# EAGLE design module_HC05 (EAGLE 9.4.1)
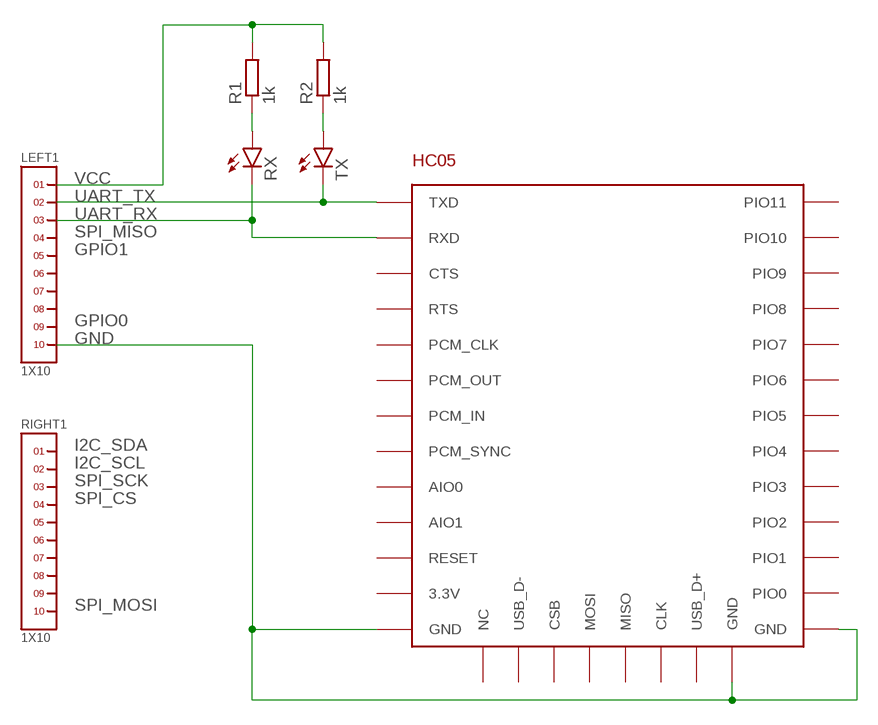
[diagram p0: schematic, sheet 1]

## Parts
LEFT1  1X10  [1X10]
R1  1k  R-EU_R0603  [R0603]
R2  1k  R-EU_R0603  [R0603]
RIGHT1  1X10  [1X10]
RX  LEDCHIP-LED0603  [CHIP-LED0603]
TX  LEDCHIP-LED0603  [CHIP-LED0603]
U$1  HC05  [HC05]

## Nets
GND: LEFT1.10 U$1.GND@1(GND) U$1.GND@2(GND) U$1.GND@3(GND)
N$1: R2.1 TX.A
N$2: R1.1 RX.A
N$3: LEFT1.2 TX.C U$1.TX(TXD)
N$4: LEFT1.3 RX.C U$1.RX(RXD)
VCC: LEFT1.1 R1.2 R2.2
Unconnected: LEFT1.4 LEFT1.5 LEFT1.6 LEFT1.7 LEFT1.8 LEFT1.9 RIGHT1.1 RIGHT1.2 RIGHT1.3 RIGHT1.4 RIGHT1.5 RIGHT1.6 RIGHT1.7 RIGHT1.8 RIGHT1.9 RIGHT1.10 U$1.3.3V U$1.AIO0 U$1.AIO1 U$1.CLK U$1.CSB U$1.CTS U$1.MISO U$1.MOSI U$1.NC U$1.PCM_CLK U$1.PCM_IN U$1.PCM_OUT U$1.PCM_SYNC U$1.PIO0 U$1.PIO1 U$1.PIO2 U$1.PIO3 U$1.PIO4 U$1.PIO5 U$1.PIO6 U$1.PIO7 U$1.PIO8 U$1.PIO9 U$1.PIO10 U$1.PIO11 U$1.RESET U$1.RTS U$1.USB_D+ U$1.USB_D-

## Notes on the sheet
- VCC
- UART_TX
- UART_RX
- SPI_MISO
- GPIO1
- GPIO0
- GND
- I2C_SDA
- I2C_SCL
- SPI_SCK
- SPI_CS
- SPI_MOSI

## Library data of the parts
LEFT1 RIGHT1 = headers(2mm):1X10
R1 R2 = rcl:R-EU_: RESISTOR, European symbol; SPICEPREFIX: R
RX TX = led:LED: LED OSRAM: - CHIPLED LG R971, LG N971, LY N971, LG Q971, LY Q971, LO R971, LY R971 LH N974, LH R974 LS Q976, LO Q976, LY Q976 LO Q996 - Hyper CHIPLED LW Q18S LB Q993, LB Q99A, LB R99A - SideLED LS A670, LO A670, LY A670, LG A670, LP A670 LB A673, LV A673, LT A673, LW A673 LH A674 LY A675 LS A676, LA A676, LO A676, LY A676, LW A676 LS A679, LY A679, LG A679 - Hyper Micro SIDELED® LS Y876, LA Y876, LO Y876, LY Y876 LT Y87S - SmartLED LW L88C, LW L88S LB L89C, LB L89S, LG L890 LS L89K, LO L89K, LY L89K LS L896, LA L896, LO L896, LY L896 - TOPLED LS T670, LO T670, LY T670, LG T670, LP T670 LSG T670, LSP T670, LSY T670, LOP T670, LYG T670 LG T671, LOG T671, LSG T671 LB T673, LV T673, LT T673, LW T673 LH T674 LS T676, LA T676, LO T676, LY T676, LB T676, LH T676, LSB T676, LW T676 LB T67C, LV T67C, LT T67C, LS T67K, LO T67K, LY T67K, LW E67C LS E67B, LA E67B, LO E67B, LY E67B, LB E67C, LV E67C, LT E67C LW T67C LS T679, LY T679, LG T679 LS T770, LO T770, LY T770, LG T770, LP T770 LB T773, LV T773, LT T773, LW T773 LH T774 LS E675, LA E675, LY E675, LS T675 LS T776, LA T776, LO T776, LY T776, LB T776 LHGB T686 LT T68C, LB T68C - Hyper Mini TOPLED® LB M676 - Mini TOPLED Santana® LG M470 LS M47K, LO M47K, LY M47K Source: http://www.osram.convergy.de LUXEON: - LUMILED® LXK2-PW12-R00, LXK2-PW12-S00, LXK2-PW14-U00, LXK2-PW14-V00 LXK2-PM12-R00, LXK2-PM12-S00, LXK2-PM14-U00 LXK2-PE12-Q00, LXK2-PE12-R00, LXK2-PE12-S00, LXK2-PE14-T00, LXK2-PE14-U00 LXK2-PB12-K00, LXK2-PB12-L00, LXK2-PB12-M00, LXK2-PB14-N00, LXK2-PB14-P00, LXK2-PB14-Q00 LXK2-PR12-L00, LXK2-PR12-M00, LXK2-PR14-Q00, LXK2-PR14-R00 LXK2-PD12-Q00, LXK2-PD12-R00, LXK2-PD12-S00 LXK2-PH12-R00, LXK2-PH12-S00 LXK2-PL12-P00, LXK2-PL12-Q00, LXK2-PL12-R00 Source: www.luxeon.com KINGBRIGHT: KA-3528ASYC Source: www.kingbright.com
U$1 = RadioShield:HC05

## Board
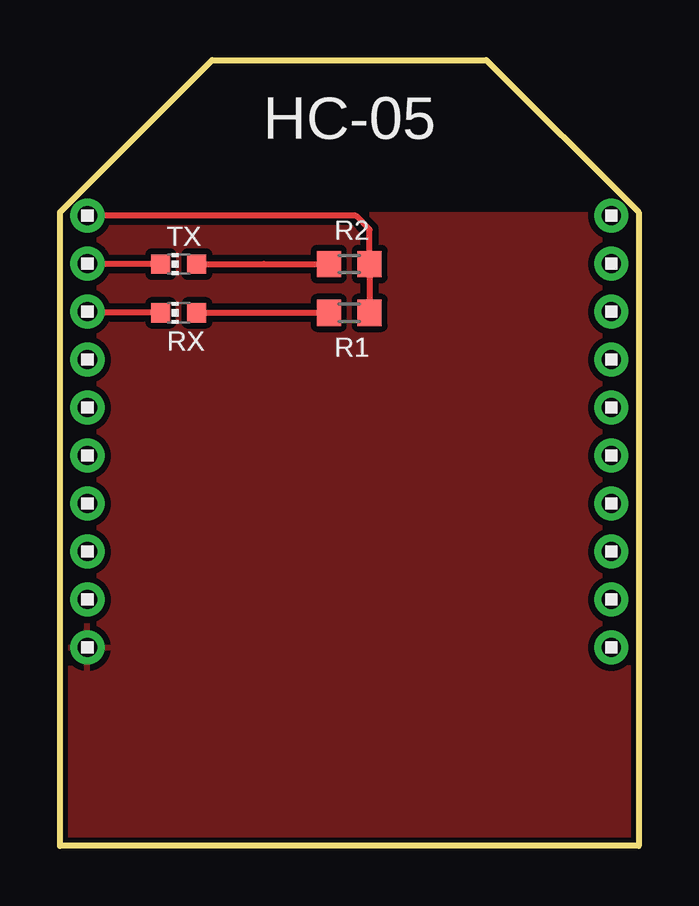
[diagram p1: board, top side]
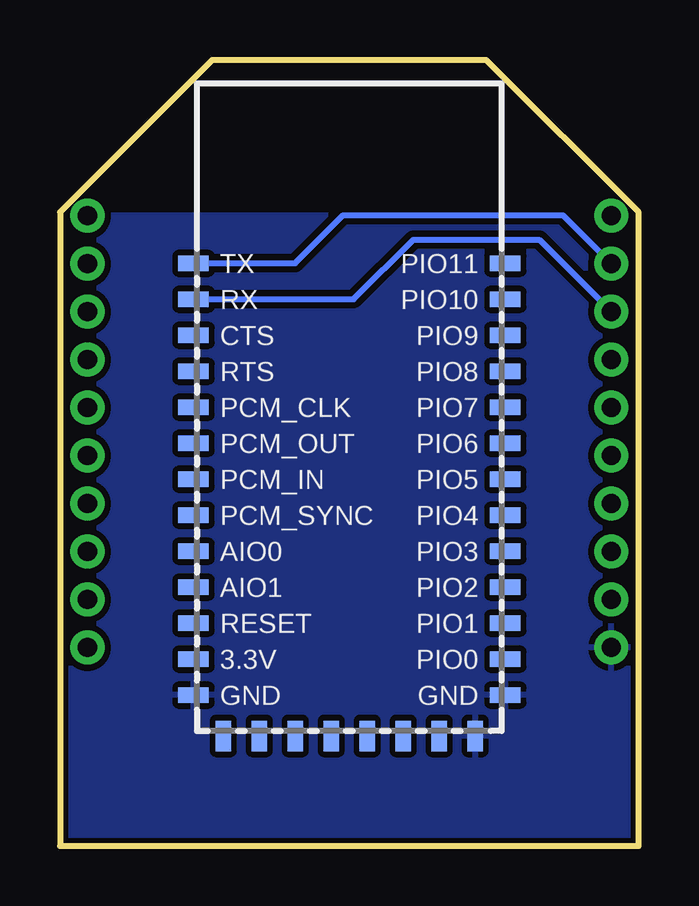
[diagram p2: board, bottom side, seen from below]

Size 24.13 x 32.77 mm. Coordinates in mm from the lower left corner, seen from the top.
Outline: 0,0 0,26.42 6.35,32.77 17.78,32.77 24.13,26.42 24.13,0 0,0
Copper layers (1*16): Top 0.035mm / dielectric 1.5mm / Bottom 0.035mm
Design rules "SparkFun-2-layer-STANDARD": minimum track width 10mil, minimum drill 20mil, track to track 10mil, track to pad 8mil, pad to pad 8mil, via to via 10mil, smd to smd 8mil, copper to edge 8mil, drill to drill 8mil, minimum pad ring 10mil, minimum via ring 10mil, stop-mask expansion 4mil, vias tented up to drill 25mil, thermal gap 10mil

### Footprints (pad centres in the part's own frame; a part is rotated, then mirrored left to right if it is on the bottom)
1X10 = drill 0.8 pad 1.422: 1 -9,0; 2 -7,0; 3 -5,0; 4 -3,0; 5 -1,0; 6 1,0; 7 3,0; 8 5,0; 9 7,0; 10 9,0
R0603 = smd 1 x 1.1: 1 -0.85,0; 2 0.85,0
CHIP-LED0603 = smd 0.8 x 0.8: A 0,-0.75; C 0,0.75
HC05 = smd 1.27 x 0.635: 3.3V -6.5,-10.5; AIO0 -6.5,-6; AIO1 -6.5,-7.5; CTS -6.5,3; GND@1 -6.5,-12; GND@3 6.5,-12; PCM_CLK -6.5,0; PCM_IN -6.5,-3; PCM_OUT -6.5,-1.5; PCM_SYNC -6.5,-4.5; PIO0 6.5,-10.5; PIO1 6.5,-9; PIO2 6.5,-7.5; PIO3 6.5,-6; PIO4 6.5,-4.5; PIO5 6.5,-3; PIO6 6.5,-1.5; PIO7 6.5,0; PIO8 6.5,1.5; PIO9 6.5,3; PIO10 6.5,4.5; PIO11 6.5,6; RESET -6.5,-9; RTS -6.5,1.5; RX -6.5,4.5; TX -6.5,6 | smd 0.635 x 1.27: CLK 2.25,-13.7; CSB -2.25,-13.7; GND@2 5.25,-13.7; MISO 0.75,-13.7; MOSI -0.75,-13.7; NC -5.25,-13.7; USB_D+ 3.75,-13.7; USB_D- -3.75,-13.7

### Placement (x,y rotation side)
LEFT1  1.14,17.27 270 top
R1  12.06,22.23 0 top
R2  12.06,24.26 0 top
RIGHT1  22.99,17.27 270 top
RX  4.95,22.23 90 top
TX  4.95,24.26 90 top
U$1  12.06,18.29 0 bottom

### Tracks (layer width: path | path; a pad name or v marks a point on that pad's centre or on a via)
GND
  pour Top: -0.25,-0.25 24.38,-0.25 24.38,26.29 -0.25,26.29
  pour Bottom: -0.51,-0.51 24.64,-0.51 24.64,26.29 -0.51,26.29
N$1
  Top 0.254: TX.A 8.51,24.26 | 8.51,24.26 R2.1 | 8.51,24.26
N$2
  Top 0.254: RX.A R1.1
N$3
  Top 0.254: TX.C 1.16,24.26 LEFT1.2
  Bottom 0.254: U$1.TX 14.32,24.29 12.32,26.29 3.16,26.29 LEFT1.2
N$4
  Top 0.254: RX.C 1.19,22.23 LEFT1.3
  Bottom 0.254: U$1.RX 11.88,22.79 9.4,25.27 4.14,25.27 LEFT1.3
VCC
  Top 0.254: R1.2 R2.2 12.91,25.69 12.34,26.27 LEFT1.1

### Text on the board
tNames: HC-05
_tNames: TX | R2 | RX | R1